# Altium schematic sheet P18 CONNECT DDR1.SchDoc
size 420 x 297 mm
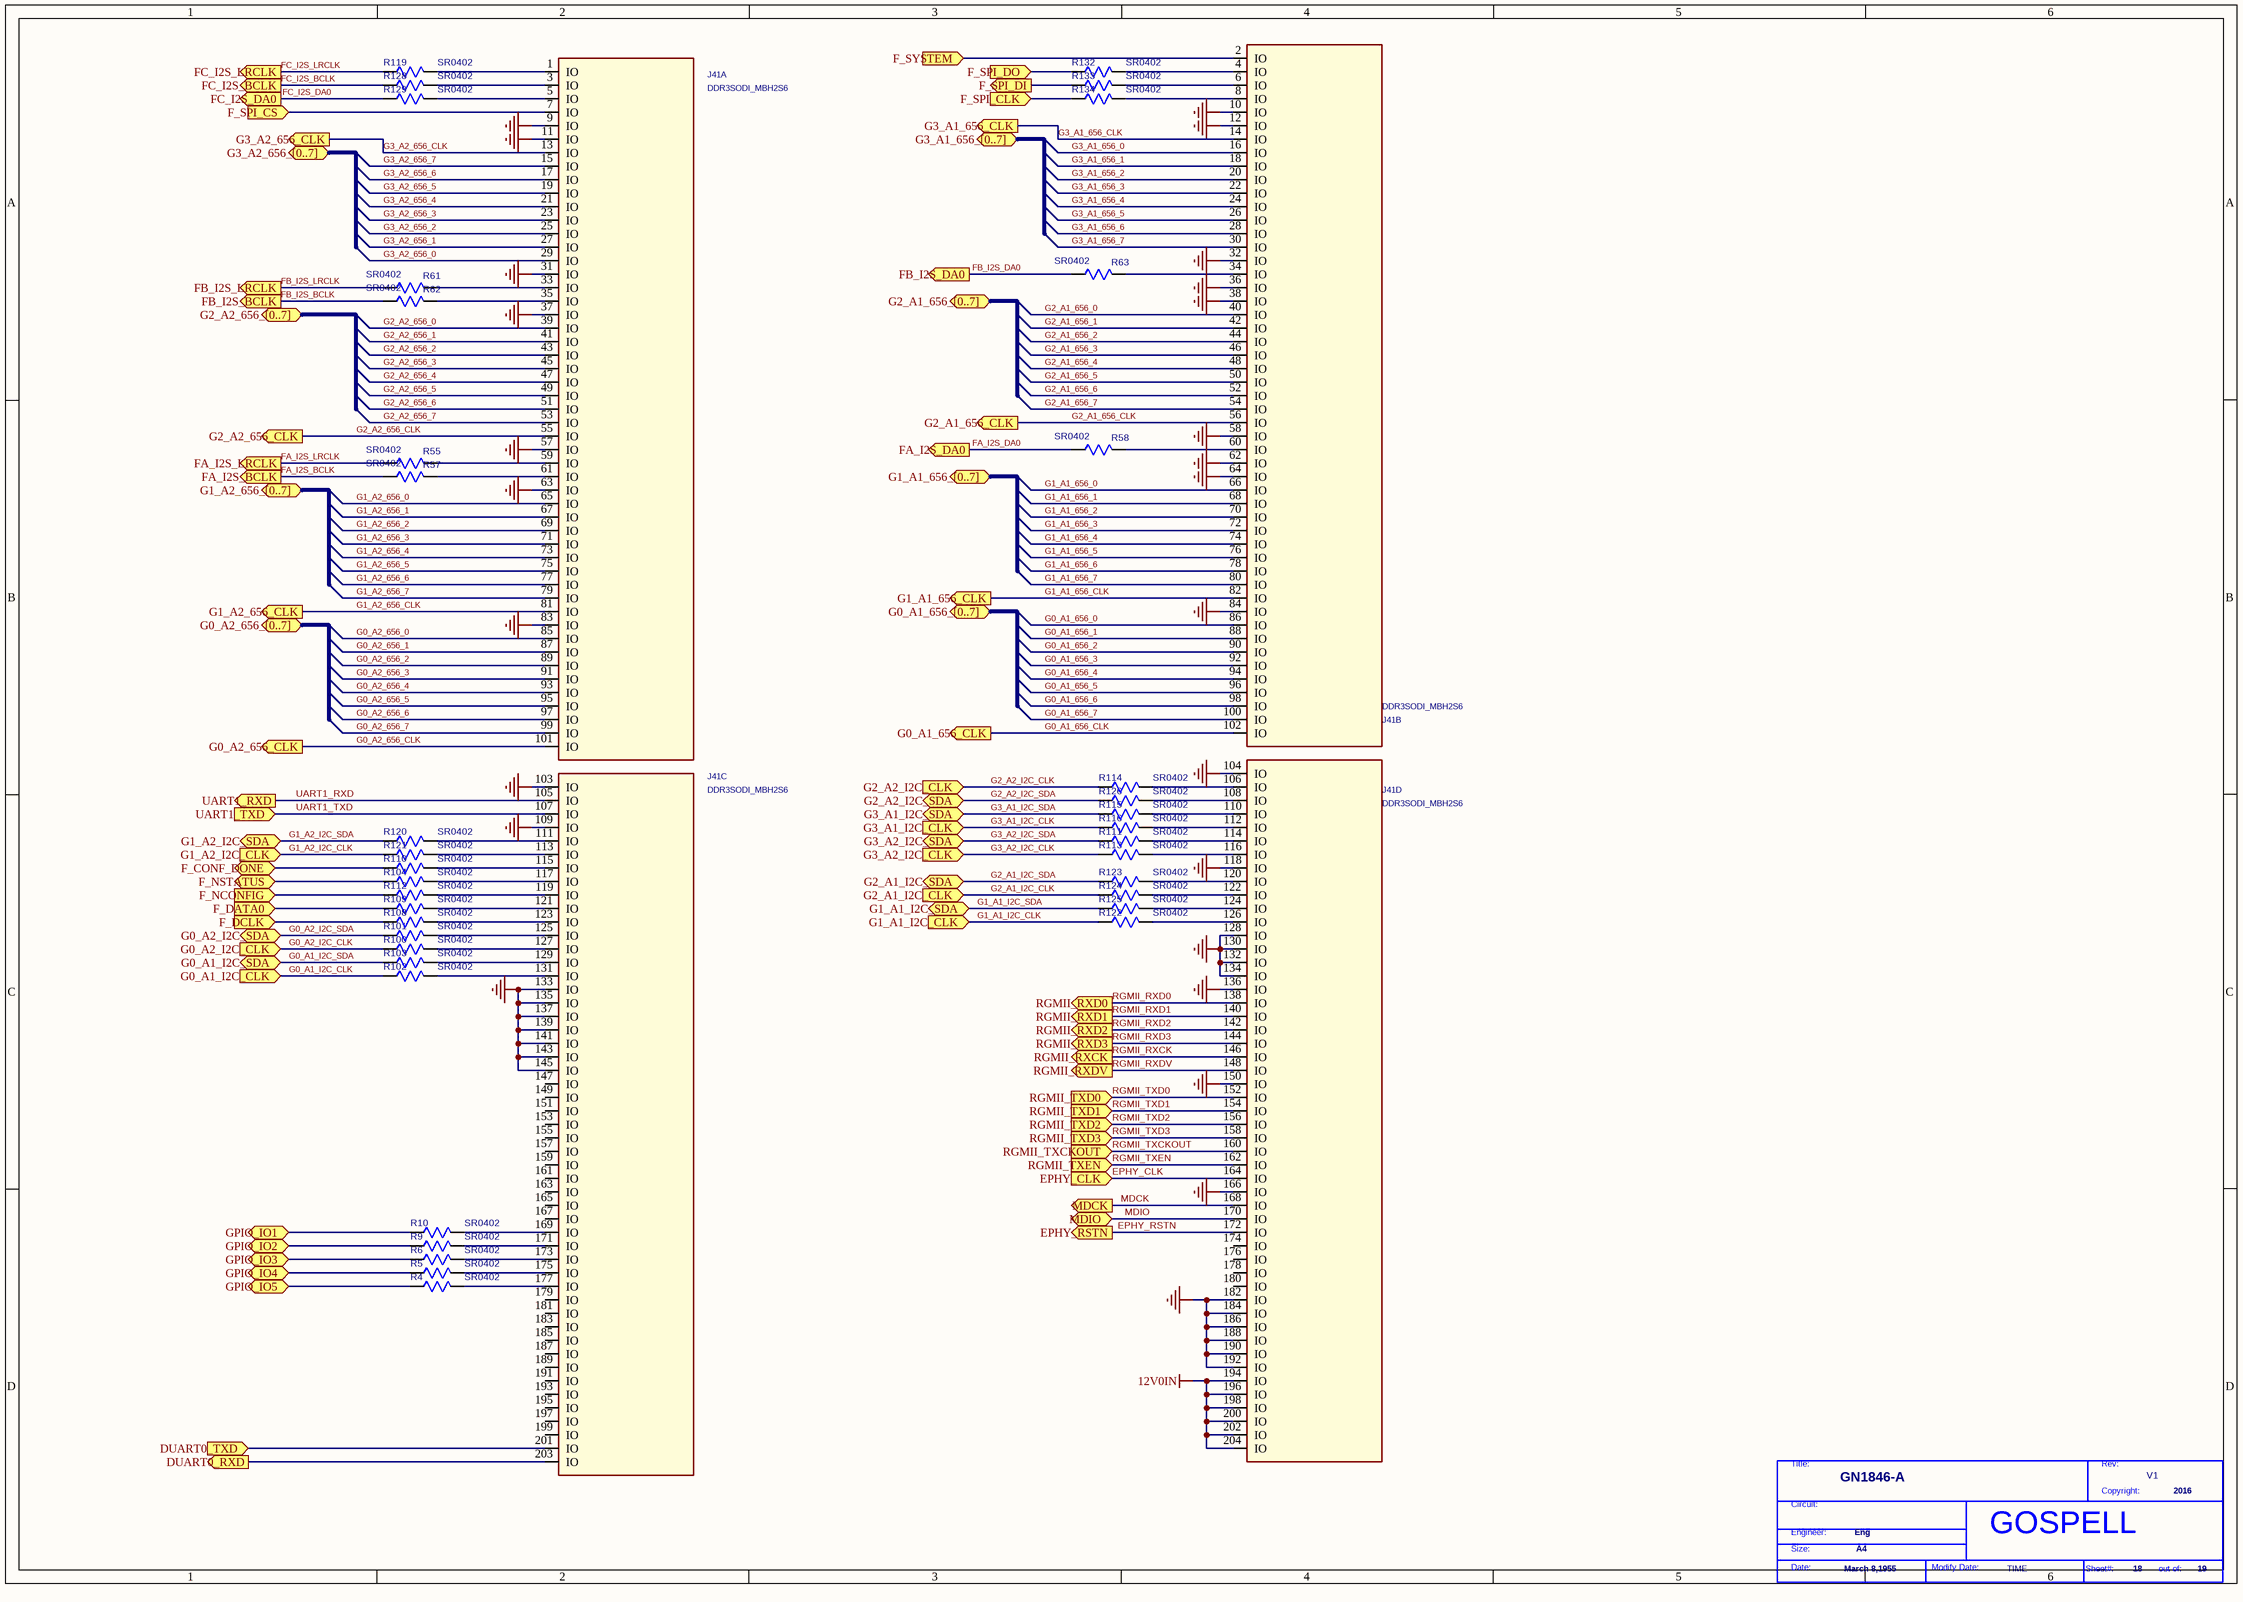
[diagram p0: P18 CONNECT DDR1.SchDoc]

## Parts
*  Page Modify Date: TIME  Engineer: Eng  Copyright: 2016  Title: GN1846-A  RevCode: V1  Page Size: A4  Page Create Date: March 8,1955  Page Number: 18  Page Count: 19  (hidden comment: GOSPELL)  (graphical)
J41  DDR3SODI_MBH2S6  [DDR3SODI_MBH2S6]  (parts A,B,C,D of 4)
R4  SR0402  [SR0402]
R5  SR0402  [SR0402]
R6  SR0402  [SR0402]
R9  SR0402  [SR0402]
R10  SR0402  [SR0402]
R55  SR0402  [SR0402]
R57  SR0402  [SR0402]
R58  SR0402  [SR0402]
R61  SR0402  [SR0402]
R62  SR0402  [SR0402]
R63  SR0402  [SR0402]
R100  SR0402  [SR0402]
R101  SR0402  [SR0402]
R102  SR0402  [SR0402]
R103  SR0402  [SR0402]
R104  SR0402  [SR0402]
R108  SR0402  [SR0402]
R109  SR0402  [SR0402]
R110  SR0402  [SR0402]
R111  SR0402  [SR0402]
R112  SR0402  [SR0402]
R113  SR0402  [SR0402]
R114  SR0402  [SR0402]
R115  SR0402  [SR0402]
R116  SR0402  [SR0402]
R119  SR0402  [SR0402]
R120  SR0402  [SR0402]
R121  SR0402  [SR0402]
R122  SR0402  [SR0402]
R123  SR0402  [SR0402]
R124  SR0402  [SR0402]
R125  SR0402  [SR0402]
R126  SR0402  [SR0402]
R128  SR0402  [SR0402]
R129  SR0402  [SR0402]
R132  SR0402  [SR0402]
R133  SR0402  [SR0402]
R134  SR0402  [SR0402]

## Ports
DUART0_RXD (out), DUART0_TXD (in), EPHY_CLK (in), EPHY_RSTN (out), F_CONF_DONE (bidir), F_DATA0 (in), F_DCLK (in), F_NCONFIG (in), F_NSTATUS (bidir), F_SPI_CLK (in), F_SPI_CS (in), F_SPI_DI (out), F_SPI_DO (in), F_SYSTEM (in), FA_I2S_BCLK (out), FA_I2S_DA0 (out), FA_I2S_LRCLK (out), FB_I2S_BCLK (out), FB_I2S_DA0 (out), FB_I2S_LRCLK (out), FC_I2S_BCLK (out), FC_I2S_DA0 (out), FC_I2S_LRCLK (out), G0_A1_656_[0..7] (bidir), G0_A1_656_CLK (out), G0_A1_I2C_CLK (in), G0_A1_I2C_SDA (bidir), G0_A2_656_[0..7] (bidir), G0_A2_656_CLK (out), G0_A2_I2C_CLK (in), G0_A2_I2C_SDA (bidir), G1_A1_656_[0..7] (bidir), G1_A1_656_CLK (out), G1_A1_I2C_CLK (in), G1_A1_I2C_SDA (bidir), G1_A2_656_[0..7] (bidir), G1_A2_656_CLK (out), G1_A2_I2C_CLK (in), G1_A2_I2C_SDA (bidir), G2_A1_656_[0..7] (bidir), G2_A1_656_CLK (out), G2_A1_I2C_CLK (in), G2_A1_I2C_SDA (bidir), G2_A2_656_[0..7] (bidir), G2_A2_656_CLK (out), G2_A2_I2C_CLK (in), G2_A2_I2C_SDA (bidir), G3_A1_656_[0..7] (bidir), G3_A1_656_CLK (out), G3_A1_I2C_CLK (in), G3_A1_I2C_SDA (bidir), G3_A2_656_[0..7] (bidir), G3_A2_656_CLK (out), G3_A2_I2C_CLK (in), G3_A2_I2C_SDA (bidir), GPIO_IO1 (bidir), GPIO_IO2 (bidir), GPIO_IO3 (bidir), GPIO_IO4 (bidir), GPIO_IO5 (bidir), MDCK (out), MDIO (bidir), RGMII_RXCK (out), RGMII_RXD0 (out), RGMII_RXD1 (out), RGMII_RXD2 (out), RGMII_RXD3 (out), RGMII_RXDV (out), RGMII_TXCKOUT (in), RGMII_TXD0 (in), RGMII_TXD1 (in), RGMII_TXD2 (in), RGMII_TXD3 (in), RGMII_TXEN (in), UART1_RXD (out), UART1_TXD (in)

## Nets
12V0IN: J41.194(IO) J41.196(IO) J41.198(IO) J41.200(IO) J41.202(IO) J41.204(IO)
GND: J41.9(IO) J41.10(IO) J41.11(IO) J41.12(IO) J41.31(IO) J41.32(IO) J41.36(IO) J41.37(IO) J41.38(IO) J41.57(IO) J41.58(IO) J41.62(IO) J41.63(IO) J41.64(IO) J41.83(IO) J41.84(IO) J41.103(IO) J41.104(IO) J41.109(IO) J41.118(IO) J41.128(IO) J41.130(IO) J41.132(IO) J41.133(IO) J41.134(IO) J41.135(IO) J41.136(IO) J41.137(IO) J41.139(IO) J41.141(IO) J41.143(IO) J41.145(IO) J41.150(IO) J41.166(IO) J41.182(IO) J41.184(IO) J41.186(IO) J41.188(IO) J41.190(IO) J41.192(IO)
DUART0_RXD: J41.203(IO) ; port DUART0_RXD
DUART0_TXD: J41.201(IO) ; port DUART0_TXD
EPHY_CLK: J41.164(IO) ; port EPHY_CLK
EPHY_RSTN: J41.172(IO) ; port EPHY_RSTN
F_CONF_DONE: R110.1(A) ; port F_CONF_DONE
F_DATA0: R109.1(A) ; port F_DATA0
F_DCLK: R108.1(A) ; port F_DCLK
F_NCONFIG: R112.1(A) ; port F_NCONFIG
F_NSTATUS: R104.1(A) ; port F_NSTATUS
F_SPI_CLK: R134.1(A) ; port F_SPI_CLK
F_SPI_CS: J41.7(IO) ; port F_SPI_CS
F_SPI_DI: R133.1(A) ; port F_SPI_DI
F_SPI_DO: R132.1(A) ; port F_SPI_DO
F_SYSTEM: J41.2(IO) ; port F_SYSTEM
FA_I2S_BCLK: R57.2(B) ; port FA_I2S_BCLK
FA_I2S_DA0: R58.2(B) ; port FA_I2S_DA0
FA_I2S_LRCLK: R55.2(B) ; port FA_I2S_LRCLK
FB_I2S_BCLK: R62.2(B) ; port FB_I2S_BCLK
FB_I2S_DA0: R63.2(B) ; port FB_I2S_DA0
FB_I2S_LRCLK: R61.2(B) ; port FB_I2S_LRCLK
FC_I2S_BCLK: R128.1(A) ; port FC_I2S_BCLK
FC_I2S_DA0: R129.1(A) ; port FC_I2S_DA0
FC_I2S_LRCLK: R119.1(A) ; port FC_I2S_LRCLK
G0_A1_656_0: J41.86(IO)
G0_A1_656_1: J41.88(IO)
G0_A1_656_2: J41.90(IO)
G0_A1_656_3: J41.92(IO)
G0_A1_656_4: J41.94(IO)
G0_A1_656_5: J41.96(IO)
G0_A1_656_6: J41.98(IO)
G0_A1_656_7: J41.100(IO)
G0_A1_656_CLK: J41.102(IO) ; port G0_A1_656_CLK
G0_A1_I2C_CLK: R102.1(A) ; port G0_A1_I2C_CLK
G0_A1_I2C_SDA: R103.1(A) ; port G0_A1_I2C_SDA
G0_A2_656_0: J41.85(IO)
G0_A2_656_1: J41.87(IO)
G0_A2_656_2: J41.89(IO)
G0_A2_656_3: J41.91(IO)
G0_A2_656_4: J41.93(IO)
G0_A2_656_5: J41.95(IO)
G0_A2_656_6: J41.97(IO)
G0_A2_656_7: J41.99(IO)
G0_A2_656_CLK: J41.101(IO) ; port G0_A2_656_CLK
G0_A2_I2C_CLK: R100.1(A) ; port G0_A2_I2C_CLK
G0_A2_I2C_SDA: R101.1(A) ; port G0_A2_I2C_SDA
G1_A1_656_0: J41.66(IO)
G1_A1_656_1: J41.68(IO)
G1_A1_656_2: J41.70(IO)
G1_A1_656_3: J41.72(IO)
G1_A1_656_4: J41.74(IO)
G1_A1_656_5: J41.76(IO)
G1_A1_656_6: J41.78(IO)
G1_A1_656_7: J41.80(IO)
G1_A1_656_CLK: J41.82(IO) ; port G1_A1_656_CLK
G1_A1_I2C_CLK: R122.1(A) ; port G1_A1_I2C_CLK
G1_A1_I2C_SDA: R125.1(A) ; port G1_A1_I2C_SDA
G1_A2_656_0: J41.65(IO)
G1_A2_656_1: J41.67(IO)
G1_A2_656_2: J41.69(IO)
G1_A2_656_3: J41.71(IO)
G1_A2_656_4: J41.73(IO)
G1_A2_656_5: J41.75(IO)
G1_A2_656_6: J41.77(IO)
G1_A2_656_7: J41.79(IO)
G1_A2_656_CLK: J41.81(IO) ; port G1_A2_656_CLK
G1_A2_I2C_CLK: R121.1(A) ; port G1_A2_I2C_CLK
G1_A2_I2C_SDA: R120.1(A) ; port G1_A2_I2C_SDA
G2_A1_656_0: J41.40(IO)
G2_A1_656_1: J41.42(IO)
G2_A1_656_2: J41.44(IO)
G2_A1_656_3: J41.46(IO)
G2_A1_656_4: J41.48(IO)
G2_A1_656_5: J41.50(IO)
G2_A1_656_6: J41.52(IO)
G2_A1_656_7: J41.54(IO)
G2_A1_656_CLK: J41.56(IO) ; port G2_A1_656_CLK
G2_A1_I2C_CLK: R124.1(A) ; port G2_A1_I2C_CLK
G2_A1_I2C_SDA: R123.1(A) ; port G2_A1_I2C_SDA
G2_A2_656_0: J41.39(IO)
G2_A2_656_1: J41.41(IO)
G2_A2_656_2: J41.43(IO)
G2_A2_656_3: J41.45(IO)
G2_A2_656_4: J41.47(IO)
G2_A2_656_5: J41.49(IO)
G2_A2_656_6: J41.51(IO)
G2_A2_656_7: J41.53(IO)
G2_A2_656_CLK: J41.55(IO) ; port G2_A2_656_CLK
G2_A2_I2C_CLK: R114.1(A) ; port G2_A2_I2C_CLK
G2_A2_I2C_SDA: R126.1(A) ; port G2_A2_I2C_SDA
G3_A1_656_0: J41.16(IO)
G3_A1_656_1: J41.18(IO)
G3_A1_656_2: J41.20(IO)
G3_A1_656_3: J41.22(IO)
G3_A1_656_4: J41.24(IO)
G3_A1_656_5: J41.26(IO)
G3_A1_656_6: J41.28(IO)
G3_A1_656_7: J41.30(IO)
G3_A1_656_CLK: J41.14(IO) ; port G3_A1_656_CLK
G3_A1_I2C_CLK: R116.1(A) ; port G3_A1_I2C_CLK
G3_A1_I2C_SDA: R115.1(A) ; port G3_A1_I2C_SDA
G3_A2_656_0: J41.29(IO)
G3_A2_656_1: J41.27(IO)
G3_A2_656_2: J41.25(IO)
G3_A2_656_3: J41.23(IO)
G3_A2_656_4: J41.21(IO)
G3_A2_656_5: J41.19(IO)
G3_A2_656_6: J41.17(IO)
G3_A2_656_7: J41.15(IO)
G3_A2_656_CLK: J41.13(IO) ; port G3_A2_656_CLK
G3_A2_I2C_CLK: R113.1(A) ; port G3_A2_I2C_CLK
G3_A2_I2C_SDA: R111.1(A) ; port G3_A2_I2C_SDA
GPIO_IO1: R10.1(A) ; port GPIO_IO1
GPIO_IO2: R9.1(A) ; port GPIO_IO2
GPIO_IO3: R6.1(A) ; port GPIO_IO3
GPIO_IO4: R5.1(A) ; port GPIO_IO4
GPIO_IO5: R4.1(A) ; port GPIO_IO5
MDCK: J41.168(IO) ; port MDCK
MDIO: J41.170(IO) ; port MDIO
RGMII_RXCK: J41.146(IO) ; port RGMII_RXCK
RGMII_RXD0: J41.138(IO) ; port RGMII_RXD0
RGMII_RXD1: J41.140(IO) ; port RGMII_RXD1
RGMII_RXD2: J41.142(IO) ; port RGMII_RXD2
RGMII_RXD3: J41.144(IO) ; port RGMII_RXD3
RGMII_RXDV: J41.148(IO) ; port RGMII_RXDV
RGMII_TXCKOUT: J41.160(IO) ; port RGMII_TXCKOUT
RGMII_TXD0: J41.152(IO) ; port RGMII_TXD0
RGMII_TXD1: J41.154(IO) ; port RGMII_TXD1
RGMII_TXD2: J41.156(IO) ; port RGMII_TXD2
RGMII_TXD3: J41.158(IO) ; port RGMII_TXD3
RGMII_TXEN: J41.162(IO) ; port RGMII_TXEN
UART1_RXD: J41.105(IO) ; port UART1_RXD
UART1_TXD: J41.107(IO) ; port UART1_TXD
NetJ41_1: J41.1(IO) R119.2(B)
NetJ41_3: J41.3(IO) R128.2(B)
NetJ41_4: J41.4(IO) R132.2(B)
NetJ41_5: J41.5(IO) R129.2(B)
NetJ41_6: J41.6(IO) R133.2(B)
NetJ41_8: J41.8(IO) R134.2(B)
NetJ41_33: J41.33(IO) R61.1(A)
NetJ41_34: J41.34(IO) R63.1(A)
NetJ41_35: J41.35(IO) R62.1(A)
NetJ41_59: J41.59(IO) R55.1(A)
NetJ41_60: J41.60(IO) R58.1(A)
NetJ41_61: J41.61(IO) R57.1(A)
NetJ41_106: J41.106(IO) R114.2(B)
NetJ41_108: J41.108(IO) R126.2(B)
NetJ41_110: J41.110(IO) R115.2(B)
NetJ41_111: J41.111(IO) R120.2(B)
NetJ41_112: J41.112(IO) R116.2(B)
NetJ41_113: J41.113(IO) R121.2(B)
NetJ41_114: J41.114(IO) R111.2(B)
NetJ41_115: J41.115(IO) R110.2(B)
NetJ41_116: J41.116(IO) R113.2(B)
NetJ41_117: J41.117(IO) R104.2(B)
NetJ41_119: J41.119(IO) R112.2(B)
NetJ41_120: J41.120(IO) R123.2(B)
NetJ41_121: J41.121(IO) R109.2(B)
NetJ41_122: J41.122(IO) R124.2(B)
NetJ41_123: J41.123(IO) R108.2(B)
NetJ41_124: J41.124(IO) R125.2(B)
NetJ41_125: J41.125(IO) R101.2(B)
NetJ41_126: J41.126(IO) R122.2(B)
NetJ41_127: J41.127(IO) R100.2(B)
NetJ41_129: J41.129(IO) R103.2(B)
NetJ41_131: J41.131(IO) R102.2(B)
NetJ41_169: J41.169(IO) R10.2(B)
NetJ41_171: J41.171(IO) R9.2(B)
NetJ41_173: J41.173(IO) R6.2(B)
NetJ41_175: J41.175(IO) R5.2(B)
NetJ41_177: J41.177(IO) R4.2(B)

Not connected (* = marked no-connect by the designer): J41 147(IO) 149(IO) 151(IO) 153(IO) 155(IO) 157(IO) 159(IO) 161(IO) 163(IO) 165(IO) 167(IO) 174(IO) 176(IO) 178(IO) 179(IO) 180(IO) 181(IO) 183(IO) 185(IO) 187(IO) 189(IO) 191(IO) 193(IO) 195(IO) 197(IO) 199(IO)

## Notes on the sheet
- (in symbol GOSPELL) Title:; Rev:; Copyright:; Circuit:; Engineer:; Size:; Date:; Modify Date:; Sheet#:; out of:

## Library data of the parts
* = GOSPELL: Cage Code: 2017
J41 = DDRSD_MB: SWAP_INFO: (S1+S2+S3+S4); SPLIT_INST: TRUE
R4-R6 R9 R10 R108 R109 R112 R119-R121 R128 R129 = R_1: PARTS: 1; LEVEL: STD; DEVICE: RC0402FR_0733RL; PINSWAP: (A,B); OriginalSymbolOrigin: (10,20); %208%%161%%192%%224%%195%%251%%179%%198%: 片式厚膜电阻器; COMPONENT_HIGH_MAX: 0.4MM; %215%%232%%214%%181%%212%%202%%208%%237%%198%%171%%178%%238%: +/-1%; %182%%238%%182%%168%%185%%166%%194%%202%(W): 0.06; %195%%232%%202%%246%: 片式厚膜电阻器-0.0625W-33OHM-+/-1%-0402; CODE: 7090836; PKG_TYPE: SR0402
R55 R57 R58 R61-R63 = R_1: PARTS: 1; LEVEL: STD; DEVICE: RK73B1ELTP472J; PINSWAP: (A,B); OriginalSymbolOrigin: (10,20); %208%%161%%192%%224%%195%%251%%179%%198%: 片式厚膜电阻器; COMPONENT_HIGH_MAX: 0.4MM; %215%%232%%214%%181%%212%%202%%208%%237%%198%%171%%178%%238%: +/-5%; %182%%238%%182%%168%%185%%166%%194%%202%(W): 0.06; %195%%232%%202%%246%: 片式厚膜电阻器-0.0625W-4700OHM-+/-5%-0402-BT; CODE: 7090793; PKG_TYPE: SR0402
R100-R104 R110 R111 R113-R116 R122-R126 R132-R134 = R_1: PARTS: 1; LEVEL: STD; DEVICE: RC0402FR_0733RL; PINSWAP: (A,B); OriginalSymbolOrigin: (10,20); CODE: 7090836; %195%%232%%202%%246%: 片式厚膜电阻器-0.0625W-33OHM-+/-1%-0402; %182%%238%%182%%168%%185%%166%%194%%202%(W): 0.06; %215%%232%%214%%181%%212%%202%%208%%237%%198%%171%%178%%238%: +/-1%; COMPONENT_HIGH_MAX: 0.4MM; %208%%161%%192%%224%%195%%251%%179%%198%: 片式厚膜电阻器; PKG_TYPE: SR0402